# Altium schematic sheet 15. SOC EMIF3 & LPDDR4.SchDoc: LPDDR4 INTERFACE - 4
size 513 x 386 mm; Project: PROC154E2(001)_SK_AM69; Issue: 1.0; RevCode: E3; Page Create Date: March  8, 1995; Variant Name: Core Design; Schematic Page Number: 15; Page Number: 15; Page Size: C; Comment: MISTRAL_TITLEBLK_CSIZE_1; Page Count: 62; Schematic Page Count: 62; Name: PROC154E2 001 SK AM69; DsnPath: C:\Users\danie\Downloads\sprr466c\PROC154E3_RP\PROC154E3_SCH.DSN; SchematicName: SCHEMATIC1; PageName: 15. SOC EMIF3 & LPDDR4; PageSize: C; TopSchematic: True
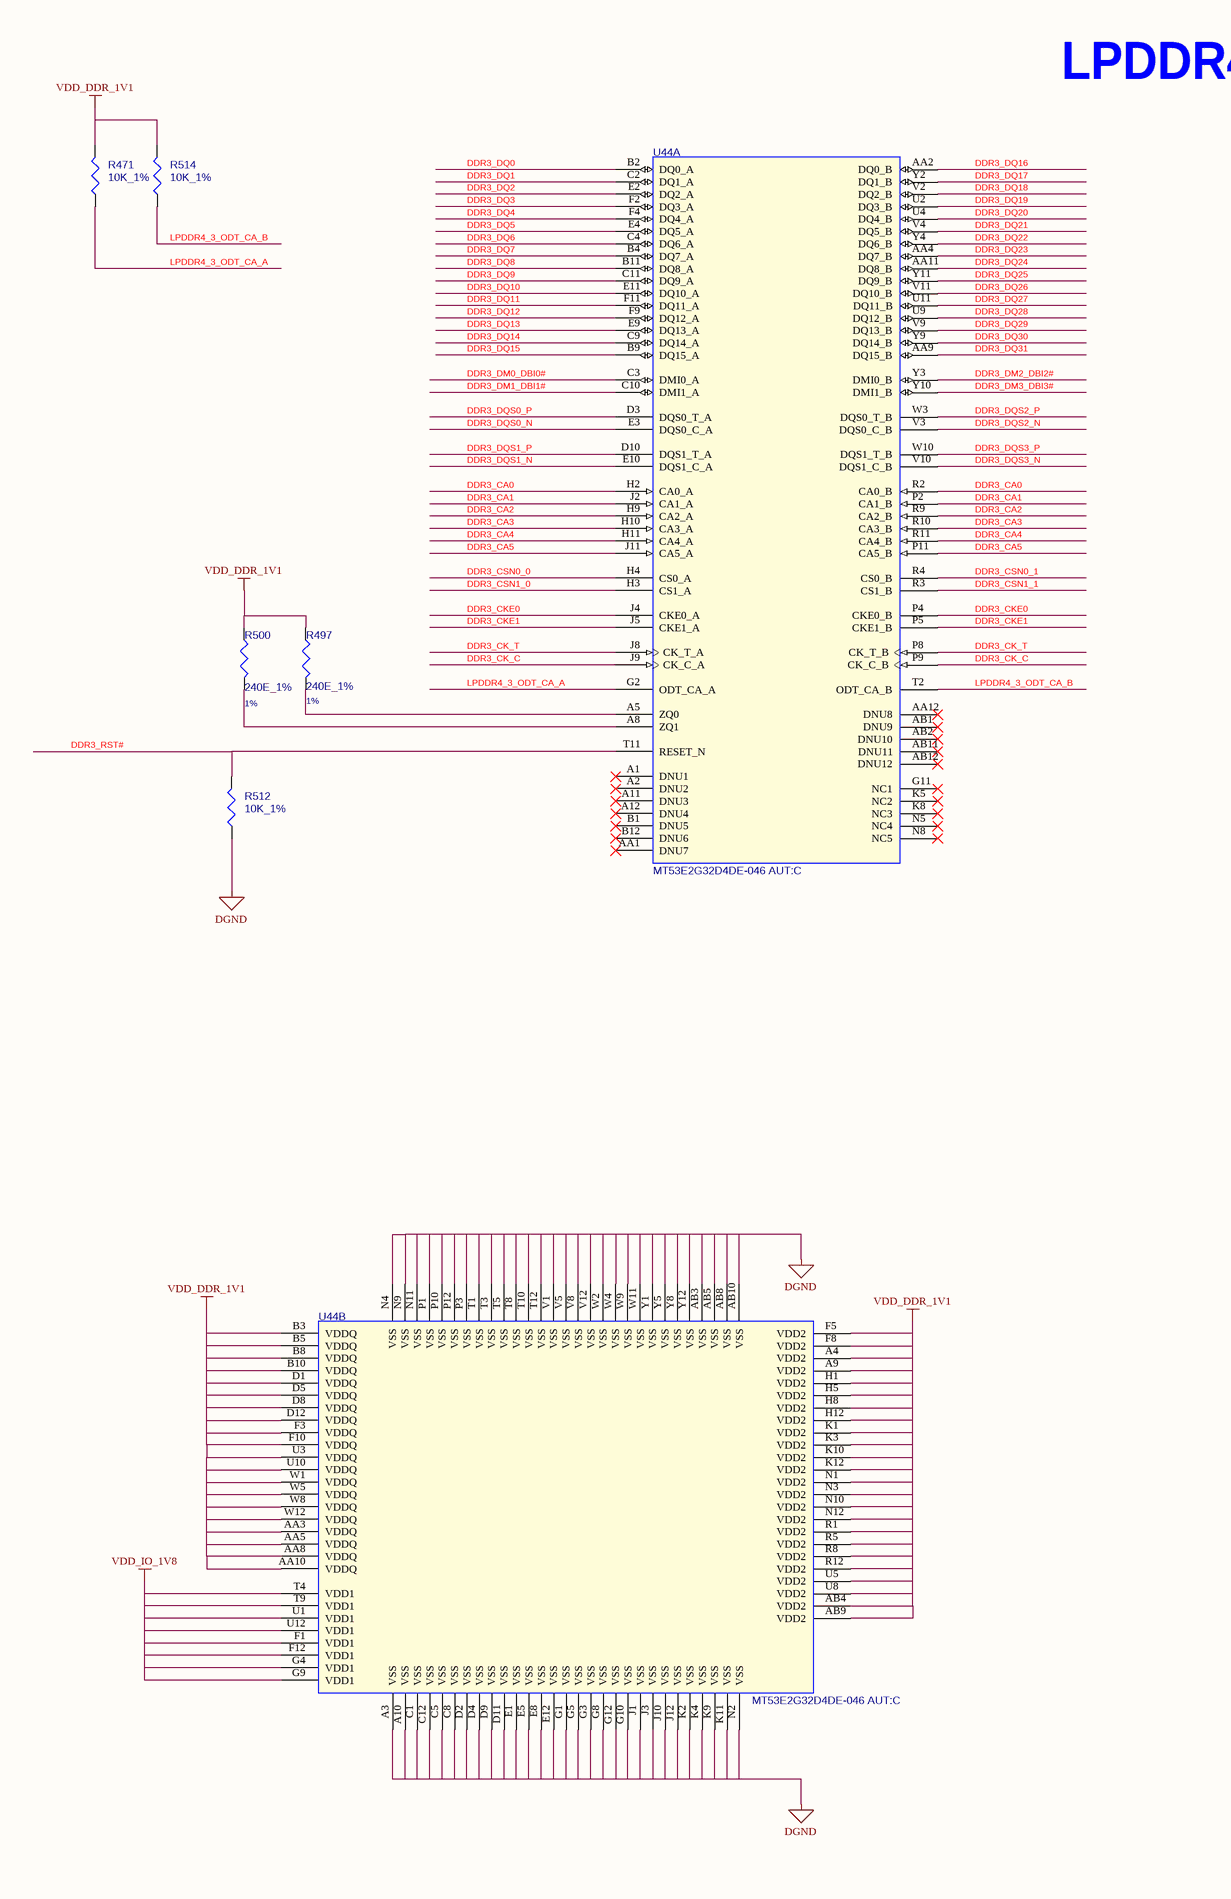
[diagram p0: 15. SOC EMIF3 & LPDDR4.SchDoc, left]
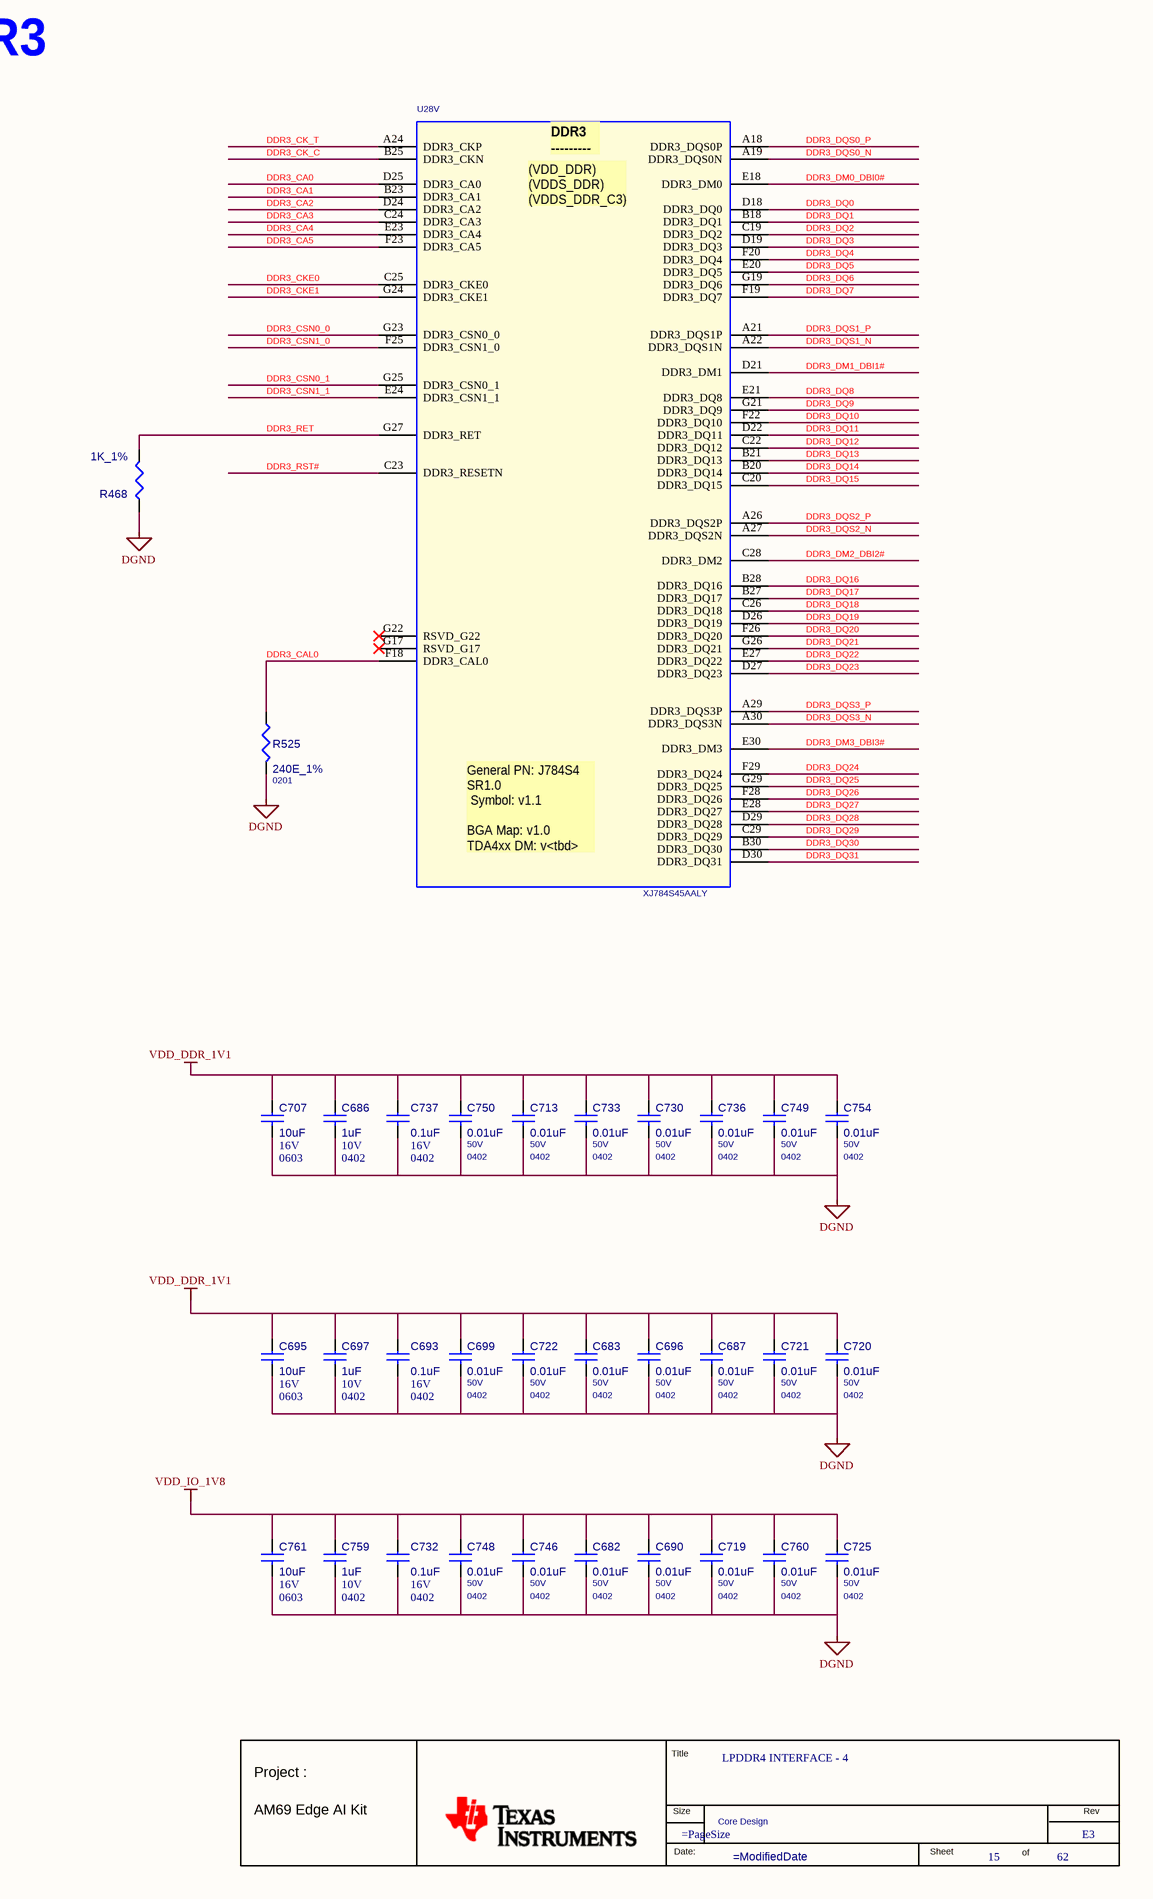
[diagram p1: 15. SOC EMIF3 & LPDDR4.SchDoc, right]

## Parts
*  RevCode: E3  Title: LPDDR4 INTERFACE - 4  Page Number: 15  Page Count: 62  Variant Name: Core Design  (hidden comment: MISTRAL_TITLEBLK_CSIZE_1)  (graphical)
C682  0.01uF  Voltage: 50V  Package: 0402  [CAP0402_0-75]
C683  0.01uF  Voltage: 50V  Package: 0402  [CAP0402_0-75]
C686  1uF  Voltage: 10V  Package: 0402  [CAP0402_0-75]
C687  0.01uF  Voltage: 50V  Package: 0402  [CAP0402_0-75]
C690  0.01uF  Voltage: 50V  Package: 0402  [CAP0402_0-75]
C693  0.1uF  Package: 0402  Voltage: 16V  [CAP0402_0-75]
C695  10uF  Package: 0603  Voltage: 16V  [CAP0603_1]
C696  0.01uF  Voltage: 50V  Package: 0402  [CAP0402_0-75]
C697  1uF  Package: 0402  Voltage: 10V  [CAP0402_0-75]
C699  0.01uF  Voltage: 50V  Package: 0402  [CAP0402_0-75]
C707  10uF  Voltage: 16V  Package: 0603  [CAP0603_1]
C713  0.01uF  Package: 0402  Voltage: 50V  [CAP0402_0-75]
C719  0.01uF  Voltage: 50V  Package: 0402  [CAP0402_0-75]
C720  0.01uF  Voltage: 50V  Package: 0402  [CAP0402_0-75]
C721  0.01uF  Voltage: 50V  Package: 0402  [CAP0402_0-75]
C722  0.01uF  Voltage: 50V  Package: 0402  [CAP0402_0-75]
C725  0.01uF  Voltage: 50V  Package: 0402  [CAP0402_0-75]
C730  0.01uF  Package: 0402  Voltage: 50V  [CAP0402_0-75]
C732  0.1uF  Package: 0402  Voltage: 16V  [CAP0402_0-75]
C733  0.01uF  Package: 0402  Voltage: 50V  [CAP0402_0-75]
C736  0.01uF  Package: 0402  Voltage: 50V  [CAP0402_0-75]
C737  0.1uF  Voltage: 16V  Package: 0402  [CAP0402_0-75]
C746  0.01uF  Voltage: 50V  Package: 0402  [CAP0402_0-75]
C748  0.01uF  Voltage: 50V  Package: 0402  [CAP0402_0-75]
C749  0.01uF  Package: 0402  Voltage: 50V  [CAP0402_0-75]
C750  0.01uF  Package: 0402  Voltage: 50V  [CAP0402_0-75]
C754  0.01uF  Package: 0402  Voltage: 50V  [CAP0402_0-75]
C759  1uF  Package: 0402  Voltage: 10V  [CAP0402_0-75]
C760  0.01uF  Voltage: 50V  Package: 0402  [CAP0402_0-75]
C761  10uF  Package: 0603  Voltage: 16V  [CAP0603_1]
R468  1K_1%  [RES0402_0-5]
R471  10K_1%  [RES0402_0-5]
R497  240E_1%  Tolerance: 1%  [RES0201_0-5]
R500  240E_1%  Tolerance: 1%  [RES0201_0-5]
R512  10K_1%  [RES0402_0-5]
R514  10K_1%  [RES0402_0-5]
R525  240E_1%  Package: 0201  [RES0201_0-5]
U28  XJ784S45AALY  [BGA1414_31-49_1230X1230_2-7]  (part V of 26)
U44  MT53E2G32D4DE-046 AUT:C  [WFBGA200_MT53DDS_400X570_1-2]  (parts A,B of 2)

## Nets
DGND: C682.2 C683.2 C686.2 C687.2 C690.2 C693.2 C695.2 C696.2 C697.2 C699.2 C707.2 C713.2 C719.2 C720.2 C721.2 C722.2 C725.2 C730.2 C732.2 C733.2 C736.2 C737.2 C746.2 C748.2 C749.2 C750.2 C754.2 C759.2 C760.2 C761.2 R468.2 R512.1 R525.2 U44.A3(VSS) U44.A10(VSS) U44.AB3(VSS) U44.AB5(VSS) U44.AB8(VSS) U44.AB10(VSS) U44.C1(VSS) U44.C5(VSS) U44.C8(VSS) U44.C12(VSS) U44.D2(VSS) U44.D4(VSS) U44.D9(VSS) U44.D11(VSS) U44.E1(VSS) U44.E5(VSS) U44.E8(VSS) U44.E12(VSS) U44.G1(VSS) U44.G3(VSS) U44.G5(VSS) U44.G8(VSS) U44.G10(VSS) U44.G12(VSS) U44.J1(VSS) U44.J3(VSS) U44.J10(VSS) U44.J12(VSS) U44.K2(VSS) U44.K4(VSS) U44.K9(VSS) U44.K11(VSS) U44.N2(VSS) U44.N4(VSS) U44.N9(VSS) U44.N11(VSS) U44.P1(VSS) U44.P3(VSS) U44.P10(VSS) U44.P12(VSS) U44.T1(VSS) U44.T3(VSS) U44.T5(VSS) U44.T8(VSS) U44.T10(VSS) U44.T12(VSS) U44.V1(VSS) U44.V5(VSS) U44.V8(VSS) U44.V12(VSS) U44.W2(VSS) U44.W4(VSS) U44.W9(VSS) U44.W11(VSS) U44.Y1(VSS) U44.Y5(VSS) U44.Y8(VSS) U44.Y12(VSS)
VDD_DDR_1V1: C683.1 C686.1 C687.1 C693.1 C695.1 C696.1 C697.1 C699.1 C707.1 C713.1 C720.1 C721.1 C722.1 C730.1 C733.1 C736.1 C737.1 C749.1 C750.1 C754.1 R471.2 R497.1 R500.1 R514.2 U44.A4(VDD2) U44.A9(VDD2) U44.AA3(VDDQ) U44.AA5(VDDQ) U44.AA8(VDDQ) U44.AA10(VDDQ) U44.AB4(VDD2) U44.AB9(VDD2) U44.B3(VDDQ) U44.B5(VDDQ) U44.B8(VDDQ) U44.B10(VDDQ) U44.D1(VDDQ) U44.D5(VDDQ) U44.D8(VDDQ) U44.D12(VDDQ) U44.F3(VDDQ) U44.F5(VDD2) U44.F8(VDD2) U44.F10(VDDQ) U44.H1(VDD2) U44.H5(VDD2) U44.H8(VDD2) U44.H12(VDD2) U44.K1(VDD2) U44.K3(VDD2) U44.K10(VDD2) U44.K12(VDD2) U44.N1(VDD2) U44.N3(VDD2) U44.N10(VDD2) U44.N12(VDD2) U44.R1(VDD2) U44.R5(VDD2) U44.R8(VDD2) U44.R12(VDD2) U44.U3(VDDQ) U44.U5(VDD2) U44.U8(VDD2) U44.U10(VDDQ) U44.W1(VDDQ) U44.W5(VDDQ) U44.W8(VDDQ) U44.W12(VDDQ)
VDD_IO_1V8: C682.1 C690.1 C719.1 C725.1 C732.1 C746.1 C748.1 C759.1 C760.1 C761.1 U44.F1(VDD1) U44.F12(VDD1) U44.G4(VDD1) U44.G9(VDD1) U44.T4(VDD1) U44.T9(VDD1) U44.U1(VDD1) U44.U12(VDD1)
DDR3_CA0: U28.D25(DDR3_CA0) U44.H2(CA0_A) U44.R2(CA0_B)
DDR3_CA1: U28.B23(DDR3_CA1) U44.J2(CA1_A) U44.P2(CA1_B)
DDR3_CA2: U28.D24(DDR3_CA2) U44.H9(CA2_A) U44.R9(CA2_B)
DDR3_CA3: U28.C24(DDR3_CA3) U44.H10(CA3_A) U44.R10(CA3_B)
DDR3_CA4: U28.E23(DDR3_CA4) U44.H11(CA4_A) U44.R11(CA4_B)
DDR3_CA5: U28.F23(DDR3_CA5) U44.J11(CA5_A) U44.P11(CA5_B)
DDR3_CAL0: R525.1 U28.F18(DDR3_CAL0)
DDR3_CK_C: U28.B25(DDR3_CKN) U44.J9(CK_C_A) U44.P9(CK_C_B)
DDR3_CK_T: U28.A24(DDR3_CKP) U44.J8(CK_T_A) U44.P8(CK_T_B)
DDR3_CKE0: U28.C25(DDR3_CKE0) U44.J4(CKE0_A) U44.P4(CKE0_B)
DDR3_CKE1: U28.G24(DDR3_CKE1) U44.J5(CKE1_A) U44.P5(CKE1_B)
DDR3_CSN0_0: U28.G23(DDR3_CSN0_0) U44.H4(CS0_A)
DDR3_CSN0_1: U28.G25(DDR3_CSN0_1) U44.R4(CS0_B)
DDR3_CSN1_0: U28.F25(DDR3_CSN1_0) U44.H3(CS1_A)
DDR3_CSN1_1: U28.E24(DDR3_CSN1_1) U44.R3(CS1_B)
DDR3_DM0_DBI0#: U28.E18(DDR3_DM0) U44.C3(DMI0_A)
DDR3_DM1_DBI1#: U28.D21(DDR3_DM1) U44.C10(DMI1_A)
DDR3_DM2_DBI2#: U28.C28(DDR3_DM2) U44.Y3(DMI0_B)
DDR3_DM3_DBI3#: U28.E30(DDR3_DM3) U44.Y10(DMI1_B)
DDR3_DQ0: U28.D18(DDR3_DQ0) U44.B2(DQ0_A)
DDR3_DQ1: U28.B18(DDR3_DQ1) U44.C2(DQ1_A)
DDR3_DQ2: U28.C19(DDR3_DQ2) U44.E2(DQ2_A)
DDR3_DQ3: U28.D19(DDR3_DQ3) U44.F2(DQ3_A)
DDR3_DQ4: U28.F20(DDR3_DQ4) U44.F4(DQ4_A)
DDR3_DQ5: U28.E20(DDR3_DQ5) U44.E4(DQ5_A)
DDR3_DQ6: U28.G19(DDR3_DQ6) U44.C4(DQ6_A)
DDR3_DQ7: U28.F19(DDR3_DQ7) U44.B4(DQ7_A)
DDR3_DQ8: U28.E21(DDR3_DQ8) U44.B11(DQ8_A)
DDR3_DQ9: U28.G21(DDR3_DQ9) U44.C11(DQ9_A)
DDR3_DQ10: U28.F22(DDR3_DQ10) U44.E11(DQ10_A)
DDR3_DQ11: U28.D22(DDR3_DQ11) U44.F11(DQ11_A)
DDR3_DQ12: U28.C22(DDR3_DQ12) U44.F9(DQ12_A)
DDR3_DQ13: U28.B21(DDR3_DQ13) U44.E9(DQ13_A)
DDR3_DQ14: U28.B20(DDR3_DQ14) U44.C9(DQ14_A)
DDR3_DQ15: U28.C20(DDR3_DQ15) U44.B9(DQ15_A)
DDR3_DQ16: U28.B28(DDR3_DQ16) U44.AA2(DQ0_B)
DDR3_DQ17: U28.B27(DDR3_DQ17) U44.Y2(DQ1_B)
DDR3_DQ18: U28.C26(DDR3_DQ18) U44.V2(DQ2_B)
DDR3_DQ19: U28.D26(DDR3_DQ19) U44.U2(DQ3_B)
DDR3_DQ20: U28.F26(DDR3_DQ20) U44.U4(DQ4_B)
DDR3_DQ21: U28.G26(DDR3_DQ21) U44.V4(DQ5_B)
DDR3_DQ22: U28.E27(DDR3_DQ22) U44.Y4(DQ6_B)
DDR3_DQ23: U28.D27(DDR3_DQ23) U44.AA4(DQ7_B)
DDR3_DQ24: U28.F29(DDR3_DQ24) U44.AA11(DQ8_B)
DDR3_DQ25: U28.G29(DDR3_DQ25) U44.Y11(DQ9_B)
DDR3_DQ26: U28.F28(DDR3_DQ26) U44.V11(DQ10_B)
DDR3_DQ27: U28.E28(DDR3_DQ27) U44.U11(DQ11_B)
DDR3_DQ28: U28.D29(DDR3_DQ28) U44.U9(DQ12_B)
DDR3_DQ29: U28.C29(DDR3_DQ29) U44.V9(DQ13_B)
DDR3_DQ30: U28.B30(DDR3_DQ30) U44.Y9(DQ14_B)
DDR3_DQ31: U28.D30(DDR3_DQ31) U44.AA9(DQ15_B)
DDR3_DQS0_N: U28.A19(DDR3_DQS0N) U44.E3(DQS0_C_A)
DDR3_DQS0_P: U28.A18(DDR3_DQS0P) U44.D3(DQS0_T_A)
DDR3_DQS1_N: U28.A22(DDR3_DQS1N) U44.E10(DQS1_C_A)
DDR3_DQS1_P: U28.A21(DDR3_DQS1P) U44.D10(DQS1_T_A)
DDR3_DQS2_N: U28.A27(DDR3_DQS2N) U44.V3(DQS0_C_B)
DDR3_DQS2_P: U28.A26(DDR3_DQS2P) U44.W3(DQS0_T_B)
DDR3_DQS3_N: U28.A30(DDR3_DQS3N) U44.V10(DQS1_C_B)
DDR3_DQS3_P: U28.A29(DDR3_DQS3P) U44.W10(DQS1_T_B)
DDR3_RET: R468.1 U28.G27(DDR3_RET)
DDR3_RST#: R512.2 U28.C23(DDR3_RESETN) U44.T11(RESET_N)
LPDDR4_3_ODT_CA_A: R471.1 U44.G2(ODT_CA_A)
LPDDR4_3_ODT_CA_B: R514.1 U44.T2(ODT_CA_B)
NetR497_2: R497.2 U44.A5(ZQ0)
NetR500_2: R500.2 U44.A8(ZQ1)

Not connected (* = marked no-connect by the designer): U28 G17(RSVD_G17)* G22(RSVD_G22)*; U44 A1(DNU1)* A2(DNU2)* A11(DNU3)* A12(DNU4)* AA1(DNU7)* AA12(DNU8)* AB1(DNU9)* AB2(DNU10)* AB11(DNU11)* AB12(DNU12)* B1(DNU5)* B12(DNU6)* G11(NC1)* K5(NC2)* K8(NC3)* N5(NC4)* N8(NC5)*

## Notes on the sheet
- LPDDR4 - DDR3
- (in symbol J7AHPSoC-EVM_BGA1414, part V) DDR3 / ---------; (VDD_DDR) / (VDDS_DDR) / (VDDS_DDR_C3); General PN: J784S4 / SR1.0 / Symbol: v1.1 / BGA Map: v1.0 / TDA4xx DM: v<tbd>
- (in symbol MISTRAL_TITLEBLK_CSIZE_1) Title; Project :; Size; Rev; AM69 Edge AI Kit; Date:; Sheet; of

## Library data of the parts
* = MISTRAL_TITLEBLK_CSIZE_1: Issue: 1.0; Project: PROC154E2(001)_SK_AM69; Name: PROC154E2 001 SK AM69; Page Create Date: March  8, 1995; Page Size: =PageSize; Page Modify Date: =ModifiedDate; Schematic Page Count: 62; Schematic Page Number: 15
C682 = CAP_Dup1: CAP CERAMIC 0.01uF 50V 10% X7R 0402; Part Reference: C682; Mistral Part No: 120009030025-R; Mfr_name: KEMET; Mfr_part_number: C0402C103K5RACTU; Part_type: CAPACITORS\CERAMIC; Direct Alternate_mfr_name: TDK; Direct Alternate_mfr_part_number: C1005X7R1H103K050BE; Automotive Alternate_mfr_part_number: CGA2B3X7R1H103K050BB; Project: G4_SVGA; Customs_HS_Code: 85322990; Custom_Duty: 15%; Wattage: NA; Value: 0.01uF; Tolerance: 10%; Distributor_name: DIGIKEY; Distributor_part_number: 399-3066-1-ND; Library Ref: CAP; Height: 0.55MM; Datasheet: Y:\MIS_DATABASE\DATASHEETS\CAPACITORS\KEMET-C-X7R.PDF; Crtd /date: MAZHAR/040505; Chkd/date: SHREESHAIL/301105; Footprint Ref: CAP0402_0-75; Weight: 0.65mg; Temperature: -55°C+125°C; MECHANICAL 3D STEP FILE: CAP0402_0-75; Library Path: Y:\MIS_DATABASE\Library\ALTIUM_TOOL\SCHEMATICS_PARTS\MS_DISCRETE_Library.schlib; Footprint Path: Y:\MIS_DATABASE\Library\ALTIUM_TOOL\PCB_FOOTPRINTS\Altium_Footprint_Lib.PcbLib; Automotive Alternate_mfr_name: TDK; PCB Footprint: CAP0402_0-75
C683 = CAP_Dup1: CAP CERAMIC 0.01uF 50V 10% X7R 0402; Part Reference: C683; Mistral Part No: 120009030025-R; Mfr_name: KEMET; Mfr_part_number: C0402C103K5RACTU; Part_type: CAPACITORS\CERAMIC; Direct Alternate_mfr_name: TDK; Direct Alternate_mfr_part_number: C1005X7R1H103K050BE; Automotive Alternate_mfr_part_number: CGA2B3X7R1H103K050BB; Project: G4_SVGA; Customs_HS_Code: 85322990; Custom_Duty: 15%; Wattage: NA; Value: 0.01uF; Tolerance: 10%; Distributor_name: DIGIKEY; Distributor_part_number: 399-3066-1-ND; Library Ref: CAP; Height: 0.55MM; Datasheet: Y:\MIS_DATABASE\DATASHEETS\CAPACITORS\KEMET-C-X7R.PDF; Crtd /date: MAZHAR/040505; Chkd/date: SHREESHAIL/301105; Footprint Ref: CAP0402_0-75; Weight: 0.65mg; Temperature: -55°C+125°C; MECHANICAL 3D STEP FILE: CAP0402_0-75; Library Path: Y:\MIS_DATABASE\Library\ALTIUM_TOOL\SCHEMATICS_PARTS\MS_DISCRETE_Library.schlib; Footprint Path: Y:\MIS_DATABASE\Library\ALTIUM_TOOL\PCB_FOOTPRINTS\Altium_Footprint_Lib.PcbLib; Automotive Alternate_mfr_name: TDK; PCB Footprint: CAP0402_0-75
C686 = CAP_Dup1: CAP CERAMIC 1uF 10V 10% X7S AUTO 0402; Part Reference: C686; Mistral Part No: 120018090021-R; Mfr_name: MURATA; Mfr_part_number: GCM155C71A105KE38D; Part_type: CAPACITORS\CERAMIC; Project: SMART-M_SCRIPTALK_PB; Wattage: NA; Customs_HS_Code: 85322990; Custom_Duty: 15%; Value: 1uF; Footprint Ref: CAP0402_0-75; Library Ref: CAP; Tolerance: 10%; Distributor_name: DIGIKEY; Distributor_part_number: 490-13409-1-ND; Height: 0.70MM; Weight: 6mg; Temperature: -55°C+125°C; Datasheet: Y:\MIS_DATABASE\DATASHEETS\CAPACITORS\MURATA-GCM-SER.PDF; Crtd /date: ALVY/100918; Chkd/date: MANIRAJA/100918; MECHANICAL 3D STEP FILE: CAP0402_0-75; Library Path: Y:\MIS_DATABASE\Library\ALTIUM_TOOL\SCHEMATICS_PARTS\MS_DISCRETE_Library.schlib; Footprint Path: Y:\MIS_DATABASE\Library\ALTIUM_TOOL\PCB_FOOTPRINTS\Altium_Footprint_Lib.PcbLib; PCB Footprint: CAP0402_0-75
C687 = CAP_Dup1: CAP CERAMIC 0.01uF 50V 10% X7R 0402; Part Reference: C687; Mistral Part No: 120009030025-R; Mfr_name: KEMET; Mfr_part_number: C0402C103K5RACTU; Part_type: CAPACITORS\CERAMIC; Direct Alternate_mfr_name: TDK; Direct Alternate_mfr_part_number: C1005X7R1H103K050BE; Automotive Alternate_mfr_part_number: CGA2B3X7R1H103K050BB; Project: G4_SVGA; Customs_HS_Code: 85322990; Custom_Duty: 15%; Wattage: NA; Value: 0.01uF; Tolerance: 10%; Distributor_name: DIGIKEY; Distributor_part_number: 399-3066-1-ND; Library Ref: CAP; Height: 0.55MM; Datasheet: Y:\MIS_DATABASE\DATASHEETS\CAPACITORS\KEMET-C-X7R.PDF; Crtd /date: MAZHAR/040505; Chkd/date: SHREESHAIL/301105; Footprint Ref: CAP0402_0-75; Weight: 0.65mg; Temperature: -55°C+125°C; MECHANICAL 3D STEP FILE: CAP0402_0-75; Library Path: Y:\MIS_DATABASE\Library\ALTIUM_TOOL\SCHEMATICS_PARTS\MS_DISCRETE_Library.schlib; Footprint Path: Y:\MIS_DATABASE\Library\ALTIUM_TOOL\PCB_FOOTPRINTS\Altium_Footprint_Lib.PcbLib; Automotive Alternate_mfr_name: TDK; PCB Footprint: CAP0402_0-75
C690 = CAP_Dup1: CAP CERAMIC 0.01uF 50V 10% X7R 0402; Part Reference: C690; Mistral Part No: 120009030025-R; Mfr_name: KEMET; Mfr_part_number: C0402C103K5RACTU; Part_type: CAPACITORS\CERAMIC; Direct Alternate_mfr_name: TDK; Direct Alternate_mfr_part_number: C1005X7R1H103K050BE; Automotive Alternate_mfr_part_number: CGA2B3X7R1H103K050BB; Project: G4_SVGA; Customs_HS_Code: 85322990; Custom_Duty: 15%; Wattage: NA; Value: 0.01uF; Tolerance: 10%; Distributor_name: DIGIKEY; Distributor_part_number: 399-3066-1-ND; Library Ref: CAP; Height: 0.55MM; Datasheet: Y:\MIS_DATABASE\DATASHEETS\CAPACITORS\KEMET-C-X7R.PDF; Crtd /date: MAZHAR/040505; Chkd/date: SHREESHAIL/301105; Footprint Ref: CAP0402_0-75; Weight: 0.65mg; Temperature: -55°C+125°C; MECHANICAL 3D STEP FILE: CAP0402_0-75; Library Path: Y:\MIS_DATABASE\Library\ALTIUM_TOOL\SCHEMATICS_PARTS\MS_DISCRETE_Library.schlib; Footprint Path: Y:\MIS_DATABASE\Library\ALTIUM_TOOL\PCB_FOOTPRINTS\Altium_Footprint_Lib.PcbLib; Automotive Alternate_mfr_name: TDK; PCB Footprint: CAP0402_0-75
C693 = CAP_Dup1: CAP CERAMIC 0.1uF 16V 5% X7R AUTO 0402; Part Reference: C693; Part_type: CAPACITORS\CERAMIC; Mfr_part_number: GCM155R71C104JA55D; Mfr_name: MURATA; Mistral Part No: 120018100055-R; Direct Alternate_mfr_name: TDK; Direct Alternate_mfr_part_number: CGA2B1X7R1C104K050BC; Custom_Duty: 15%; Customs_HS_Code: 85322990; Wattage: NA; Project: TI_J7ES_EVM_CP; Value: 0.1uF; MECHANICAL 3D STEP FILE: CAP0402_0-75; Footprint Path: Y:\MIS_DATABASE\Library\ALTIUM_TOOL\PCB_FOOTPRINTS\Altium_Footprint_Lib.PcbLib; Library Path: Y:\MIS_DATABASE\Library\ALTIUM_TOOL\SCHEMATICS_PARTS\MS_DISCRETE_Library.schlib; Footprint Ref: CAP0402_0-75; Library Ref: CAP; Chkd/date: MANIRAJA/241018; Crtd /date: ALVY/241018; Datasheet: Y:\MIS_DATABASE\DATASHEETS\CAPACITORS\GCM155R71C104JA55D.PDF; Temperature: -55°C+125°C; Weight: 6mg; Height: 0.55MM; Distributor_part_number: 490-16433-1-ND; Distributor_name: DIGIKEY; Tolerance: 5%; Automotive Alternate_mfr_name: TDK; Automotive Alternate_mfr_part_number: CGA2B1X7R1C104K050BC; PCB Footprint: CAP0402_0-75
C695 = CAP_Dup1: CAP CERAMIC 10uF 16V 20% X6S 0603; Part Reference: C695; Automotive Alternate_mfr_part_number: GRT188C81C106ME13D; Automotive Alternate_mfr_name: MURATA; Direct Alternate_mfr_part_number: CL10X106MO8NRNC; Direct Alternate_mfr_name: SAMSUNG; Part_type: CAPACITORS\CERAMIC; Mfr_part_number: GRM188C81C106MA73D; Mistral Part No: 120017010004-R; Custom_Duty: 15%; Customs_HS_Code: 85322990; Wattage: NA; Project: TRMM_SMART-M_PS; Value: 10uF; Footprint Path: Y:\MIS_DATABASE\Library\ALTIUM_TOOL\PCB_FOOTPRINTS\Altium_Footprint_Lib.PcbLib; Library Path: Y:\MIS_DATABASE\Library\ALTIUM_TOOL\SCHEMATICS_PARTS\MS_DISCRETE_Library.schlib; Footprint Ref: CAP0603_1; MECHANICAL 3D STEP FILE: CAP0603_1; Chkd/date: VASANTHA/170117; Crtd /date: VASANTHA/170117; Datasheet: Y:\MIS_DATABASE\DATASHEETS\CAPACITORS\MURATA-GXX-SER_NOV17.PDF; Temperature: -55°C+105°C; Weight: 6.3mg; Height: 0.90MM; Library Ref: CAP; Distributor_part_number: 490-7198-1-ND; Distributor_name: DIGIKEY; Tolerance: 20%; Mfr_name: MURATA; PCB Footprint: CAP0603_1
C696 = CAP_Dup1: CAP CERAMIC 0.01uF 50V 10% X7R 0402; Part Reference: C696; Mistral Part No: 120009030025-R; Mfr_name: KEMET; Mfr_part_number: C0402C103K5RACTU; Part_type: CAPACITORS\CERAMIC; Direct Alternate_mfr_name: TDK; Direct Alternate_mfr_part_number: C1005X7R1H103K050BE; Automotive Alternate_mfr_part_number: CGA2B3X7R1H103K050BB; Project: G4_SVGA; Customs_HS_Code: 85322990; Custom_Duty: 15%; Wattage: NA; Value: 0.01uF; Tolerance: 10%; Distributor_name: DIGIKEY; Distributor_part_number: 399-3066-1-ND; Library Ref: CAP; Height: 0.55MM; Datasheet: Y:\MIS_DATABASE\DATASHEETS\CAPACITORS\KEMET-C-X7R.PDF; Crtd /date: MAZHAR/040505; Chkd/date: SHREESHAIL/301105; Footprint Ref: CAP0402_0-75; Weight: 0.65mg; Temperature: -55°C+125°C; MECHANICAL 3D STEP FILE: CAP0402_0-75; Library Path: Y:\MIS_DATABASE\Library\ALTIUM_TOOL\SCHEMATICS_PARTS\MS_DISCRETE_Library.schlib; Footprint Path: Y:\MIS_DATABASE\Library\ALTIUM_TOOL\PCB_FOOTPRINTS\Altium_Footprint_Lib.PcbLib; Automotive Alternate_mfr_name: TDK; PCB Footprint: CAP0402_0-75
C697 = CAP_Dup1: CAP CERAMIC 1uF 10V 10% X7S AUTO 0402; Part Reference: C697; Part_type: CAPACITORS\CERAMIC; Mfr_part_number: GCM155C71A105KE38D; Mfr_name: MURATA; Mistral Part No: 120018090021-R; Custom_Duty: 15%; Customs_HS_Code: 85322990; Wattage: NA; Project: SMART-M_SCRIPTALK_PB; Value: 1uF; Footprint Path: Y:\MIS_DATABASE\Library\ALTIUM_TOOL\PCB_FOOTPRINTS\Altium_Footprint_Lib.PcbLib; Library Path: Y:\MIS_DATABASE\Library\ALTIUM_TOOL\SCHEMATICS_PARTS\MS_DISCRETE_Library.schlib; MECHANICAL 3D STEP FILE: CAP0402_0-75; Chkd/date: MANIRAJA/100918; Crtd /date: ALVY/100918; Datasheet: Y:\MIS_DATABASE\DATASHEETS\CAPACITORS\MURATA-GCM-SER.PDF; Temperature: -55°C+125°C; Weight: 6mg; Height: 0.70MM; Distributor_part_number: 490-13409-1-ND; Distributor_name: DIGIKEY; Tolerance: 10%; Library Ref: CAP; Footprint Ref: CAP0402_0-75; PCB Footprint: CAP0402_0-75
C699 = CAP_Dup1: CAP CERAMIC 0.01uF 50V 10% X7R 0402; Part Reference: C699; Mistral Part No: 120009030025-R; Mfr_name: KEMET; Mfr_part_number: C0402C103K5RACTU; Part_type: CAPACITORS\CERAMIC; Direct Alternate_mfr_name: TDK; Direct Alternate_mfr_part_number: C1005X7R1H103K050BE; Automotive Alternate_mfr_part_number: CGA2B3X7R1H103K050BB; Project: G4_SVGA; Customs_HS_Code: 85322990; Custom_Duty: 15%; Wattage: NA; Value: 0.01uF; Tolerance: 10%; Distributor_name: DIGIKEY; Distributor_part_number: 399-3066-1-ND; Library Ref: CAP; Height: 0.55MM; Datasheet: Y:\MIS_DATABASE\DATASHEETS\CAPACITORS\KEMET-C-X7R.PDF; Crtd /date: MAZHAR/040505; Chkd/date: SHREESHAIL/301105; Footprint Ref: CAP0402_0-75; Weight: 0.65mg; Temperature: -55°C+125°C; MECHANICAL 3D STEP FILE: CAP0402_0-75; Library Path: Y:\MIS_DATABASE\Library\ALTIUM_TOOL\SCHEMATICS_PARTS\MS_DISCRETE_Library.schlib; Footprint Path: Y:\MIS_DATABASE\Library\ALTIUM_TOOL\PCB_FOOTPRINTS\Altium_Footprint_Lib.PcbLib; Automotive Alternate_mfr_name: TDK; PCB Footprint: CAP0402_0-75
C707 = CAP_Dup1: CAP CERAMIC 10uF 16V 20% X6S 0603; Part Reference: C707; Mistral Part No: 120017010004-R; Mfr_name: MURATA; Mfr_part_number: GRM188C81C106MA73D; Part_type: CAPACITORS\CERAMIC; Direct Alternate_mfr_name: SAMSUNG; Direct Alternate_mfr_part_number: CL10X106MO8NRNC; Automotive Alternate_mfr_part_number: GRT188C81C106ME13D; Project: TRMM_SMART-M_PS; Wattage: NA; Customs_HS_Code: 85322990; Custom_Duty: 15%; Value: 10uF; Tolerance: 20%; Distributor_name: DIGIKEY; Distributor_part_number: 490-7198-1-ND; Library Ref: CAP; Height: 0.90MM; Weight: 6.3mg; Temperature: -55°C+105°C; Datasheet: Y:\MIS_DATABASE\DATASHEETS\CAPACITORS\MURATA-GXX-SER_NOV17.PDF; Crtd /date: VASANTHA/170117; Chkd/date: VASANTHA/170117; MECHANICAL 3D STEP FILE: CAP0603_1; Footprint Ref: CAP0603_1; Library Path: Y:\MIS_DATABASE\Library\ALTIUM_TOOL\SCHEMATICS_PARTS\MS_DISCRETE_Library.schlib; Footprint Path: Y:\MIS_DATABASE\Library\ALTIUM_TOOL\PCB_FOOTPRINTS\Altium_Footprint_Lib.PcbLib; Automotive Alternate_mfr_name: MURATA; PCB Footprint: CAP0603_1
C713 = CAP_Dup1: CAP CERAMIC 0.01uF 50V 10% X7R 0402; Part Reference: C713; Automotive Alternate_mfr_part_number: CGA2B3X7R1H103K050BB; Automotive Alternate_mfr_name: TDK; Direct Alternate_mfr_part_number: C1005X7R1H103K050BE; Part_type: CAPACITORS\CERAMIC; Mfr_part_number: C0402C103K5RACTU; Mfr_name: KEMET; Mistral Part No: 120009030025-R; Wattage: NA; Custom_Duty: 15%; Customs_HS_Code: 85322990; Project: G4_SVGA; Value: 0.01uF; Direct Alternate_mfr_name: TDK; Footprint Path: Y:\MIS_DATABASE\Library\ALTIUM_TOOL\PCB_FOOTPRINTS\Altium_Footprint_Lib.PcbLib; Library Path: Y:\MIS_DATABASE\Library\ALTIUM_TOOL\SCHEMATICS_PARTS\MS_DISCRETE_Library.schlib; MECHANICAL 3D STEP FILE: CAP0402_0-75; Temperature: -55°C+125°C; Weight: 0.65mg; Footprint Ref: CAP0402_0-75; Chkd/date: SHREESHAIL/301105; Crtd /date: MAZHAR/040505; Datasheet: Y:\MIS_DATABASE\DATASHEETS\CAPACITORS\KEMET-C-X7R.PDF; Height: 0.55MM; Library Ref: CAP; Distributor_part_number: 399-3066-1-ND; Distributor_name: DIGIKEY; Tolerance: 10%; PCB Footprint: CAP0402_0-75
C719 = CAP_Dup1: CAP CERAMIC 0.01uF 50V 10% X7R 0402; Part Reference: C719; Mistral Part No: 120009030025-R; Mfr_name: KEMET; Mfr_part_number: C0402C103K5RACTU; Part_type: CAPACITORS\CERAMIC; Direct Alternate_mfr_name: TDK; Direct Alternate_mfr_part_number: C1005X7R1H103K050BE; Automotive Alternate_mfr_part_number: CGA2B3X7R1H103K050BB; Project: G4_SVGA; Customs_HS_Code: 85322990; Custom_Duty: 15%; Wattage: NA; Value: 0.01uF; Tolerance: 10%; Distributor_name: DIGIKEY; Distributor_part_number: 399-3066-1-ND; Library Ref: CAP; Height: 0.55MM; Datasheet: Y:\MIS_DATABASE\DATASHEETS\CAPACITORS\KEMET-C-X7R.PDF; Crtd /date: MAZHAR/040505; Chkd/date: SHREESHAIL/301105; Footprint Ref: CAP0402_0-75; Weight: 0.65mg; Temperature: -55°C+125°C; MECHANICAL 3D STEP FILE: CAP0402_0-75; Library Path: Y:\MIS_DATABASE\Library\ALTIUM_TOOL\SCHEMATICS_PARTS\MS_DISCRETE_Library.schlib; Footprint Path: Y:\MIS_DATABASE\Library\ALTIUM_TOOL\PCB_FOOTPRINTS\Altium_Footprint_Lib.PcbLib; Automotive Alternate_mfr_name: TDK; PCB Footprint: CAP0402_0-75
C720 = CAP_Dup1: CAP CERAMIC 0.01uF 50V 10% X7R 0402; Part Reference: C720; Mistral Part No: 120009030025-R; Mfr_name: KEMET; Mfr_part_number: C0402C103K5RACTU; Part_type: CAPACITORS\CERAMIC; Direct Alternate_mfr_name: TDK; Direct Alternate_mfr_part_number: C1005X7R1H103K050BE; Automotive Alternate_mfr_part_number: CGA2B3X7R1H103K050BB; Project: G4_SVGA; Customs_HS_Code: 85322990; Custom_Duty: 15%; Wattage: NA; Value: 0.01uF; Tolerance: 10%; Distributor_name: DIGIKEY; Distributor_part_number: 399-3066-1-ND; Library Ref: CAP; Height: 0.55MM; Datasheet: Y:\MIS_DATABASE\DATASHEETS\CAPACITORS\KEMET-C-X7R.PDF; Crtd /date: MAZHAR/040505; Chkd/date: SHREESHAIL/301105; Footprint Ref: CAP0402_0-75; Weight: 0.65mg; Temperature: -55°C+125°C; MECHANICAL 3D STEP FILE: CAP0402_0-75; Library Path: Y:\MIS_DATABASE\Library\ALTIUM_TOOL\SCHEMATICS_PARTS\MS_DISCRETE_Library.schlib; Footprint Path: Y:\MIS_DATABASE\Library\ALTIUM_TOOL\PCB_FOOTPRINTS\Altium_Footprint_Lib.PcbLib; Automotive Alternate_mfr_name: TDK; PCB Footprint: CAP0402_0-75
C721 = CAP_Dup1: CAP CERAMIC 0.01uF 50V 10% X7R 0402; Part Reference: C721; Mistral Part No: 120009030025-R; Mfr_name: KEMET; Mfr_part_number: C0402C103K5RACTU; Part_type: CAPACITORS\CERAMIC; Direct Alternate_mfr_name: TDK; Direct Alternate_mfr_part_number: C1005X7R1H103K050BE; Automotive Alternate_mfr_part_number: CGA2B3X7R1H103K050BB; Project: G4_SVGA; Customs_HS_Code: 85322990; Custom_Duty: 15%; Wattage: NA; Value: 0.01uF; Tolerance: 10%; Distributor_name: DIGIKEY; Distributor_part_number: 399-3066-1-ND; Library Ref: CAP; Height: 0.55MM; Datasheet: Y:\MIS_DATABASE\DATASHEETS\CAPACITORS\KEMET-C-X7R.PDF; Crtd /date: MAZHAR/040505; Chkd/date: SHREESHAIL/301105; Footprint Ref: CAP0402_0-75; Weight: 0.65mg; Temperature: -55°C+125°C; MECHANICAL 3D STEP FILE: CAP0402_0-75; Library Path: Y:\MIS_DATABASE\Library\ALTIUM_TOOL\SCHEMATICS_PARTS\MS_DISCRETE_Library.schlib; Footprint Path: Y:\MIS_DATABASE\Library\ALTIUM_TOOL\PCB_FOOTPRINTS\Altium_Footprint_Lib.PcbLib; Automotive Alternate_mfr_name: TDK; PCB Footprint: CAP0402_0-75
C722 = CAP_Dup1: CAP CERAMIC 0.01uF 50V 10% X7R 0402; Part Reference: C722; Mistral Part No: 120009030025-R; Mfr_name: KEMET; Mfr_part_number: C0402C103K5RACTU; Part_type: CAPACITORS\CERAMIC; Direct Alternate_mfr_name: TDK; Direct Alternate_mfr_part_number: C1005X7R1H103K050BE; Automotive Alternate_mfr_part_number: CGA2B3X7R1H103K050BB; Project: G4_SVGA; Customs_HS_Code: 85322990; Custom_Duty: 15%; Wattage: NA; Value: 0.01uF; Tolerance: 10%; Distributor_name: DIGIKEY; Distributor_part_number: 399-3066-1-ND; Library Ref: CAP; Height: 0.55MM; Datasheet: Y:\MIS_DATABASE\DATASHEETS\CAPACITORS\KEMET-C-X7R.PDF; Crtd /date: MAZHAR/040505; Chkd/date: SHREESHAIL/301105; Footprint Ref: CAP0402_0-75; Weight: 0.65mg; Temperature: -55°C+125°C; MECHANICAL 3D STEP FILE: CAP0402_0-75; Library Path: Y:\MIS_DATABASE\Library\ALTIUM_TOOL\SCHEMATICS_PARTS\MS_DISCRETE_Library.schlib; Footprint Path: Y:\MIS_DATABASE\Library\ALTIUM_TOOL\PCB_FOOTPRINTS\Altium_Footprint_Lib.PcbLib; Automotive Alternate_mfr_name: TDK; PCB Footprint: CAP0402_0-75
C725 = CAP_Dup1: CAP CERAMIC 0.01uF 50V 10% X7R 0402; Part Reference: C725; Mistral Part No: 120009030025-R; Mfr_name: KEMET; Mfr_part_number: C0402C103K5RACTU; Part_type: CAPACITORS\CERAMIC; Direct Alternate_mfr_name: TDK; Direct Alternate_mfr_part_number: C1005X7R1H103K050BE; Automotive Alternate_mfr_part_number: CGA2B3X7R1H103K050BB; Project: G4_SVGA; Customs_HS_Code: 85322990; Custom_Duty: 15%; Wattage: NA; Value: 0.01uF; Tolerance: 10%; Distributor_name: DIGIKEY; Distributor_part_number: 399-3066-1-ND; Library Ref: CAP; Height: 0.55MM; Datasheet: Y:\MIS_DATABASE\DATASHEETS\CAPACITORS\KEMET-C-X7R.PDF; Crtd /date: MAZHAR/040505; Chkd/date: SHREESHAIL/301105; Footprint Ref: CAP0402_0-75; Weight: 0.65mg; Temperature: -55°C+125°C; MECHANICAL 3D STEP FILE: CAP0402_0-75; Library Path: Y:\MIS_DATABASE\Library\ALTIUM_TOOL\SCHEMATICS_PARTS\MS_DISCRETE_Library.schlib; Footprint Path: Y:\MIS_DATABASE\Library\ALTIUM_TOOL\PCB_FOOTPRINTS\Altium_Footprint_Lib.PcbLib; Automotive Alternate_mfr_name: TDK; PCB Footprint: CAP0402_0-75
C730 = CAP_Dup1: CAP CERAMIC 0.01uF 50V 10% X7R 0402; Part Reference: C730; Automotive Alternate_mfr_part_number: CGA2B3X7R1H103K050BB; Automotive Alternate_mfr_name: TDK; Direct Alternate_mfr_part_number: C1005X7R1H103K050BE; Part_type: CAPACITORS\CERAMIC; Mfr_part_number: C0402C103K5RACTU; Mfr_name: KEMET; Mistral Part No: 120009030025-R; Wattage: NA; Custom_Duty: 15%; Customs_HS_Code: 85322990; Project: G4_SVGA; Value: 0.01uF; Direct Alternate_mfr_name: TDK; Footprint Path: Y:\MIS_DATABASE\Library\ALTIUM_TOOL\PCB_FOOTPRINTS\Altium_Footprint_Lib.PcbLib; Library Path: Y:\MIS_DATABASE\Library\ALTIUM_TOOL\SCHEMATICS_PARTS\MS_DISCRETE_Library.schlib; MECHANICAL 3D STEP FILE: CAP0402_0-75; Temperature: -55°C+125°C; Weight: 0.65mg; Footprint Ref: CAP0402_0-75; Chkd/date: SHREESHAIL/301105; Crtd /date: MAZHAR/040505; Datasheet: Y:\MIS_DATABASE\DATASHEETS\CAPACITORS\KEMET-C-X7R.PDF; Height: 0.55MM; Library Ref: CAP; Distributor_part_number: 399-3066-1-ND; Distributor_name: DIGIKEY; Tolerance: 10%; PCB Footprint: CAP0402_0-75
C732 = CAP_Dup1: CAP CERAMIC 0.1uF 16V 5% X7R AUTO 0402; Part Reference: C732; Part_type: CAPACITORS\CERAMIC; Mfr_part_number: GCM155R71C104JA55D; Mfr_name: MURATA; Mistral Part No: 120018100055-R; Direct Alternate_mfr_name: TDK; Direct Alternate_mfr_part_number: CGA2B1X7R1C104K050BC; Custom_Duty: 15%; Customs_HS_Code: 85322990; Wattage: NA; Project: TI_J7ES_EVM_CP; Value: 0.1uF; MECHANICAL 3D STEP FILE: CAP0402_0-75; Footprint Path: Y:\MIS_DATABASE\Library\ALTIUM_TOOL\PCB_FOOTPRINTS\Altium_Footprint_Lib.PcbLib; Library Path: Y:\MIS_DATABASE\Library\ALTIUM_TOOL\SCHEMATICS_PARTS\MS_DISCRETE_Library.schlib; Footprint Ref: CAP0402_0-75; Library Ref: CAP; Chkd/date: MANIRAJA/241018; Crtd /date: ALVY/241018; Datasheet: Y:\MIS_DATABASE\DATASHEETS\CAPACITORS\GCM155R71C104JA55D.PDF; Temperature: -55°C+125°C; Weight: 6mg; Height: 0.55MM; Distributor_part_number: 490-16433-1-ND; Distributor_name: DIGIKEY; Tolerance: 5%; Automotive Alternate_mfr_name: TDK; Automotive Alternate_mfr_part_number: CGA2B1X7R1C104K050BC; PCB Footprint: CAP0402_0-75
C733 = CAP_Dup1: CAP CERAMIC 0.01uF 50V 10% X7R 0402; Part Reference: C733; Automotive Alternate_mfr_part_number: CGA2B3X7R1H103K050BB; Automotive Alternate_mfr_name: TDK; Direct Alternate_mfr_part_number: C1005X7R1H103K050BE; Part_type: CAPACITORS\CERAMIC; Mfr_part_number: C0402C103K5RACTU; Mfr_name: KEMET; Mistral Part No: 120009030025-R; Wattage: NA; Custom_Duty: 15%; Customs_HS_Code: 85322990; Project: G4_SVGA; Value: 0.01uF; Direct Alternate_mfr_name: TDK; Footprint Path: Y:\MIS_DATABASE\Library\ALTIUM_TOOL\PCB_FOOTPRINTS\Altium_Footprint_Lib.PcbLib; Library Path: Y:\MIS_DATABASE\Library\ALTIUM_TOOL\SCHEMATICS_PARTS\MS_DISCRETE_Library.schlib; MECHANICAL 3D STEP FILE: CAP0402_0-75; Temperature: -55°C+125°C; Weight: 0.65mg; Footprint Ref: CAP0402_0-75; Chkd/date: SHREESHAIL/301105; Crtd /date: MAZHAR/040505; Datasheet: Y:\MIS_DATABASE\DATASHEETS\CAPACITORS\KEMET-C-X7R.PDF; Height: 0.55MM; Library Ref: CAP; Distributor_part_number: 399-3066-1-ND; Distributor_name: DIGIKEY; Tolerance: 10%; PCB Footprint: CAP0402_0-75
C736 = CAP_Dup1: CAP CERAMIC 0.01uF 50V 10% X7R 0402; Part Reference: C736; Automotive Alternate_mfr_part_number: CGA2B3X7R1H103K050BB; Automotive Alternate_mfr_name: TDK; Direct Alternate_mfr_part_number: C1005X7R1H103K050BE; Part_type: CAPACITORS\CERAMIC; Mfr_part_number: C0402C103K5RACTU; Mfr_name: KEMET; Mistral Part No: 120009030025-R; Wattage: NA; Custom_Duty: 15%; Customs_HS_Code: 85322990; Project: G4_SVGA; Value: 0.01uF; Direct Alternate_mfr_name: TDK; Footprint Path: Y:\MIS_DATABASE\Library\ALTIUM_TOOL\PCB_FOOTPRINTS\Altium_Footprint_Lib.PcbLib; Library Path: Y:\MIS_DATABASE\Library\ALTIUM_TOOL\SCHEMATICS_PARTS\MS_DISCRETE_Library.schlib; MECHANICAL 3D STEP FILE: CAP0402_0-75; Temperature: -55°C+125°C; Weight: 0.65mg; Footprint Ref: CAP0402_0-75; Chkd/date: SHREESHAIL/301105; Crtd /date: MAZHAR/040505; Datasheet: Y:\MIS_DATABASE\DATASHEETS\CAPACITORS\KEMET-C-X7R.PDF; Height: 0.55MM; Library Ref: CAP; Distributor_part_number: 399-3066-1-ND; Distributor_name: DIGIKEY; Tolerance: 10%; PCB Footprint: CAP0402_0-75
C737 = CAP_Dup1: CAP CERAMIC 0.1uF 16V 5% X7R AUTO 0402; Part Reference: C737; Automotive Alternate_mfr_part_number: CGA2B1X7R1C104K050BC; Automotive Alternate_mfr_name: TDK; Mistral Part No: 120018100055-R; Mfr_name: MURATA; Mfr_part_number: GCM155R71C104JA55D; Part_type: CAPACITORS\CERAMIC; Project: TI_J7ES_EVM_CP; Wattage: NA; Customs_HS_Code: 85322990; Custom_Duty: 15%; Value: 0.1uF; Direct Alternate_mfr_part_number: CGA2B1X7R1C104K050BC; Direct Alternate_mfr_name: TDK; Tolerance: 5%; Distributor_name: DIGIKEY; Distributor_part_number: 490-16433-1-ND; Height: 0.55MM; Weight: 6mg; Temperature: -55°C+125°C; Datasheet: Y:\MIS_DATABASE\DATASHEETS\CAPACITORS\GCM155R71C104JA55D.PDF; Crtd /date: ALVY/241018; Chkd/date: MANIRAJA/241018; Library Ref: CAP; Footprint Ref: CAP0402_0-75; Library Path: Y:\MIS_DATABASE\Library\ALTIUM_TOOL\SCHEMATICS_PARTS\MS_DISCRETE_Library.schlib; Footprint Path: Y:\MIS_DATABASE\Library\ALTIUM_TOOL\PCB_FOOTPRINTS\Altium_Footprint_Lib.PcbLib; MECHANICAL 3D STEP FILE: CAP0402_0-75; PCB Footprint: CAP0402_0-75
C746 = CAP_Dup1: CAP CERAMIC 0.01uF 50V 10% X7R 0402; Part Reference: C746; Mistral Part No: 120009030025-R; Mfr_name: KEMET; Mfr_part_number: C0402C103K5RACTU; Part_type: CAPACITORS\CERAMIC; Direct Alternate_mfr_name: TDK; Direct Alternate_mfr_part_number: C1005X7R1H103K050BE; Automotive Alternate_mfr_part_number: CGA2B3X7R1H103K050BB; Project: G4_SVGA; Customs_HS_Code: 85322990; Custom_Duty: 15%; Wattage: NA; Value: 0.01uF; Tolerance: 10%; Distributor_name: DIGIKEY; Distributor_part_number: 399-3066-1-ND; Library Ref: CAP; Height: 0.55MM; Datasheet: Y:\MIS_DATABASE\DATASHEETS\CAPACITORS\KEMET-C-X7R.PDF; Crtd /date: MAZHAR/040505; Chkd/date: SHREESHAIL/301105; Footprint Ref: CAP0402_0-75; Weight: 0.65mg; Temperature: -55°C+125°C; MECHANICAL 3D STEP FILE: CAP0402_0-75; Library Path: Y:\MIS_DATABASE\Library\ALTIUM_TOOL\SCHEMATICS_PARTS\MS_DISCRETE_Library.schlib; Footprint Path: Y:\MIS_DATABASE\Library\ALTIUM_TOOL\PCB_FOOTPRINTS\Altium_Footprint_Lib.PcbLib; Automotive Alternate_mfr_name: TDK; PCB Footprint: CAP0402_0-75
C748 = CAP_Dup1: CAP CERAMIC 0.01uF 50V 10% X7R 0402; Part Reference: C748; Mistral Part No: 120009030025-R; Mfr_name: KEMET; Mfr_part_number: C0402C103K5RACTU; Part_type: CAPACITORS\CERAMIC; Direct Alternate_mfr_name: TDK; Direct Alternate_mfr_part_number: C1005X7R1H103K050BE; Automotive Alternate_mfr_part_number: CGA2B3X7R1H103K050BB; Project: G4_SVGA; Customs_HS_Code: 85322990; Custom_Duty: 15%; Wattage: NA; Value: 0.01uF; Tolerance: 10%; Distributor_name: DIGIKEY; Distributor_part_number: 399-3066-1-ND; Library Ref: CAP; Height: 0.55MM; Datasheet: Y:\MIS_DATABASE\DATASHEETS\CAPACITORS\KEMET-C-X7R.PDF; Crtd /date: MAZHAR/040505; Chkd/date: SHREESHAIL/301105; Footprint Ref: CAP0402_0-75; Weight: 0.65mg; Temperature: -55°C+125°C; MECHANICAL 3D STEP FILE: CAP0402_0-75; Library Path: Y:\MIS_DATABASE\Library\ALTIUM_TOOL\SCHEMATICS_PARTS\MS_DISCRETE_Library.schlib; Footprint Path: Y:\MIS_DATABASE\Library\ALTIUM_TOOL\PCB_FOOTPRINTS\Altium_Footprint_Lib.PcbLib; Automotive Alternate_mfr_name: TDK; PCB Footprint: CAP0402_0-75
C749 = CAP_Dup1: CAP CERAMIC 0.01uF 50V 10% X7R 0402; Part Reference: C749; Automotive Alternate_mfr_part_number: CGA2B3X7R1H103K050BB; Automotive Alternate_mfr_name: TDK; Direct Alternate_mfr_part_number: C1005X7R1H103K050BE; Part_type: CAPACITORS\CERAMIC; Mfr_part_number: C0402C103K5RACTU; Mfr_name: KEMET; Mistral Part No: 120009030025-R; Wattage: NA; Custom_Duty: 15%; Customs_HS_Code: 85322990; Project: G4_SVGA; Value: 0.01uF; Direct Alternate_mfr_name: TDK; Footprint Path: Y:\MIS_DATABASE\Library\ALTIUM_TOOL\PCB_FOOTPRINTS\Altium_Footprint_Lib.PcbLib; Library Path: Y:\MIS_DATABASE\Library\ALTIUM_TOOL\SCHEMATICS_PARTS\MS_DISCRETE_Library.schlib; MECHANICAL 3D STEP FILE: CAP0402_0-75; Temperature: -55°C+125°C; Weight: 0.65mg; Footprint Ref: CAP0402_0-75; Chkd/date: SHREESHAIL/301105; Crtd /date: MAZHAR/040505; Datasheet: Y:\MIS_DATABASE\DATASHEETS\CAPACITORS\KEMET-C-X7R.PDF; Height: 0.55MM; Library Ref: CAP; Distributor_part_number: 399-3066-1-ND; Distributor_name: DIGIKEY; Tolerance: 10%; PCB Footprint: CAP0402_0-75
C750 = CAP_Dup1: CAP CERAMIC 0.01uF 50V 10% X7R 0402; Part Reference: C750; Automotive Alternate_mfr_part_number: CGA2B3X7R1H103K050BB; Automotive Alternate_mfr_name: TDK; Direct Alternate_mfr_part_number: C1005X7R1H103K050BE; Part_type: CAPACITORS\CERAMIC; Mfr_part_number: C0402C103K5RACTU; Mfr_name: KEMET; Mistral Part No: 120009030025-R; Wattage: NA; Custom_Duty: 15%; Customs_HS_Code: 85322990; Project: G4_SVGA; Value: 0.01uF; Direct Alternate_mfr_name: TDK; Footprint Path: Y:\MIS_DATABASE\Library\ALTIUM_TOOL\PCB_FOOTPRINTS\Altium_Footprint_Lib.PcbLib; Library Path: Y:\MIS_DATABASE\Library\ALTIUM_TOOL\SCHEMATICS_PARTS\MS_DISCRETE_Library.schlib; MECHANICAL 3D STEP FILE: CAP0402_0-75; Temperature: -55°C+125°C; Weight: 0.65mg; Footprint Ref: CAP0402_0-75; Chkd/date: SHREESHAIL/301105; Crtd /date: MAZHAR/040505; Datasheet: Y:\MIS_DATABASE\DATASHEETS\CAPACITORS\KEMET-C-X7R.PDF; Height: 0.55MM; Library Ref: CAP; Distributor_part_number: 399-3066-1-ND; Distributor_name: DIGIKEY; Tolerance: 10%; PCB Footprint: CAP0402_0-75
C754 = CAP_Dup1: CAP CERAMIC 0.01uF 50V 10% X7R 0402; Part Reference: C754; Automotive Alternate_mfr_part_number: CGA2B3X7R1H103K050BB; Automotive Alternate_mfr_name: TDK; Direct Alternate_mfr_part_number: C1005X7R1H103K050BE; Part_type: CAPACITORS\CERAMIC; Mfr_part_number: C0402C103K5RACTU; Mfr_name: KEMET; Mistral Part No: 120009030025-R; Wattage: NA; Custom_Duty: 15%; Customs_HS_Code: 85322990; Project: G4_SVGA; Value: 0.01uF; Direct Alternate_mfr_name: TDK; Footprint Path: Y:\MIS_DATABASE\Library\ALTIUM_TOOL\PCB_FOOTPRINTS\Altium_Footprint_Lib.PcbLib; Library Path: Y:\MIS_DATABASE\Library\ALTIUM_TOOL\SCHEMATICS_PARTS\MS_DISCRETE_Library.schlib; MECHANICAL 3D STEP FILE: CAP0402_0-75; Temperature: -55°C+125°C; Weight: 0.65mg; Footprint Ref: CAP0402_0-75; Chkd/date: SHREESHAIL/301105; Crtd /date: MAZHAR/040505; Datasheet: Y:\MIS_DATABASE\DATASHEETS\CAPACITORS\KEMET-C-X7R.PDF; Height: 0.55MM; Library Ref: CAP; Distributor_part_number: 399-3066-1-ND; Distributor_name: DIGIKEY; Tolerance: 10%; PCB Footprint: CAP0402_0-75
C759 = CAP_Dup1: CAP CERAMIC 1uF 10V 10% X7S AUTO 0402; Part Reference: C759; Part_type: CAPACITORS\CERAMIC; Mfr_part_number: GCM155C71A105KE38D; Mfr_name: MURATA; Mistral Part No: 120018090021-R; Custom_Duty: 15%; Customs_HS_Code: 85322990; Wattage: NA; Project: SMART-M_SCRIPTALK_PB; Value: 1uF; Footprint Path: Y:\MIS_DATABASE\Library\ALTIUM_TOOL\PCB_FOOTPRINTS\Altium_Footprint_Lib.PcbLib; Library Path: Y:\MIS_DATABASE\Library\ALTIUM_TOOL\SCHEMATICS_PARTS\MS_DISCRETE_Library.schlib; MECHANICAL 3D STEP FILE: CAP0402_0-75; Chkd/date: MANIRAJA/100918; Crtd /date: ALVY/100918; Datasheet: Y:\MIS_DATABASE\DATASHEETS\CAPACITORS\MURATA-GCM-SER.PDF; Temperature: -55°C+125°C; Weight: 6mg; Height: 0.70MM; Distributor_part_number: 490-13409-1-ND; Distributor_name: DIGIKEY; Tolerance: 10%; Library Ref: CAP; Footprint Ref: CAP0402_0-75; PCB Footprint: CAP0402_0-75
C760 = CAP_Dup1: CAP CERAMIC 0.01uF 50V 10% X7R 0402; Part Reference: C760; Mistral Part No: 120009030025-R; Mfr_name: KEMET; Mfr_part_number: C0402C103K5RACTU; Part_type: CAPACITORS\CERAMIC; Direct Alternate_mfr_name: TDK; Direct Alternate_mfr_part_number: C1005X7R1H103K050BE; Automotive Alternate_mfr_part_number: CGA2B3X7R1H103K050BB; Project: G4_SVGA; Customs_HS_Code: 85322990; Custom_Duty: 15%; Wattage: NA; Value: 0.01uF; Tolerance: 10%; Distributor_name: DIGIKEY; Distributor_part_number: 399-3066-1-ND; Library Ref: CAP; Height: 0.55MM; Datasheet: Y:\MIS_DATABASE\DATASHEETS\CAPACITORS\KEMET-C-X7R.PDF; Crtd /date: MAZHAR/040505; Chkd/date: SHREESHAIL/301105; Footprint Ref: CAP0402_0-75; Weight: 0.65mg; Temperature: -55°C+125°C; MECHANICAL 3D STEP FILE: CAP0402_0-75; Library Path: Y:\MIS_DATABASE\Library\ALTIUM_TOOL\SCHEMATICS_PARTS\MS_DISCRETE_Library.schlib; Footprint Path: Y:\MIS_DATABASE\Library\ALTIUM_TOOL\PCB_FOOTPRINTS\Altium_Footprint_Lib.PcbLib; Automotive Alternate_mfr_name: TDK; PCB Footprint: CAP0402_0-75
C761 = CAP_Dup1: CAP CERAMIC 10uF 16V 20% X6S 0603; Part Reference: C761; Automotive Alternate_mfr_part_number: GRT188C81C106ME13D; Automotive Alternate_mfr_name: MURATA; Direct Alternate_mfr_part_number: CL10X106MO8NRNC; Direct Alternate_mfr_name: SAMSUNG; Part_type: CAPACITORS\CERAMIC; Mfr_part_number: GRM188C81C106MA73D; Mistral Part No: 120017010004-R; Custom_Duty: 15%; Customs_HS_Code: 85322990; Wattage: NA; Project: TRMM_SMART-M_PS; Value: 10uF; Footprint Path: Y:\MIS_DATABASE\Library\ALTIUM_TOOL\PCB_FOOTPRINTS\Altium_Footprint_Lib.PcbLib; Library Path: Y:\MIS_DATABASE\Library\ALTIUM_TOOL\SCHEMATICS_PARTS\MS_DISCRETE_Library.schlib; Footprint Ref: CAP0603_1; MECHANICAL 3D STEP FILE: CAP0603_1; Chkd/date: VASANTHA/170117; Crtd /date: VASANTHA/170117; Datasheet: Y:\MIS_DATABASE\DATASHEETS\CAPACITORS\MURATA-GXX-SER_NOV17.PDF; Temperature: -55°C+105°C; Weight: 6.3mg; Height: 0.90MM; Library Ref: CAP; Distributor_part_number: 490-7198-1-ND; Distributor_name: DIGIKEY; Tolerance: 20%; Mfr_name: MURATA; PCB Footprint: CAP0603_1
R468 = RESISTOR_Dup1: RES 1K 1/10W 1% 0402; Part Reference: R468; Mistral Part No: 110009030411-R; Mfr_name: PANASONIC-ECG; Mfr_part_number: ERJ-2RKF1001X; Part_type: RESISTORS\FIXED; Project: VOCERA; Voltage: NA; Customs_HS_Code: 85332119; Custom_Duty: 15%; Value: 1K_1%; Tolerance: 1%; Wattage: 1/10W; Package: 0402; Distributor_name: DIGIKEY; Distributor_part_number: P1.00KLCT-ND; Height: 0.40MM; Weight: 0.8mg; Temperature: -55°C+155°C; Datasheet: Y:\MIS_DATABASE\DATASHEETS\RESISTORS\PAN-ERJSER_NOV17.PDF; Crtd /date: MAZHAR/150506; Chkd/date: VASANTHA/281216; Library Ref: RESISTOR; Footprint Ref: RES0402_0-5; MECHANICAL 3D STEP FILE: RES0402_0-5; Library Path: Y:\MIS_DATABASE\Library\ALTIUM_TOOL\SCHEMATICS_PARTS\MS_DISCRETE_Library.schlib; Footprint Path: Y:\MIS_DATABASE\Library\ALTIUM_TOOL\PCB_FOOTPRINTS\Altium_Footprint_Lib.PcbLib; Manufacturer: PANASONIC-ECG; PCB Footprint: RES0402_0-5
R471 = RESISTOR_Dup2: RES 10K 1/16W 1% 0402; Part Reference: R471; Part_type: RESISTORS\FIXED; Mfr_part_number: RC0402FR-0710KL; Mfr_name: YAGEO AMERICA; Mistral Part No: 110015090015-R; Custom_Duty: 15%; Customs_HS_Code: 85332119; Voltage: NA; Project: VOCERA; Value: 10K_1%; MECHANICAL 3D STEP FILE: RES0402_0-5; Chkd/date: VASANTHA/201216; Crtd /date: GEETHA/290506; Datasheet: Y:\MIS_DATABASE\DATASHEETS\RESISTORS\RCXXXXL-SER_MAR18.PDF; Temperature: -55°C+155°C; Weight: 0.65mg; Height: 0.40MM; Distributor_part_number: 311-10.0KLRTR-ND; Distributor_name: DIGIKEY; Package: 0402; Wattage: 1/16W; Tolerance: 1%; Library Ref: RESISTOR; Footprint Ref: RES0402_0-5; Library Path: Y:\MIS_DATABASE\Library\ALTIUM_TOOL\SCHEMATICS_PARTS\MS_DISCRETE_Library.schlib; Footprint Path: Y:\MIS_DATABASE\Library\ALTIUM_TOOL\PCB_FOOTPRINTS\Altium_Footprint_Lib.PcbLib; PCB Footprint: RES0402_0-5
R497 = RESISTOR_Dup2: RES 240E 1/20W 1% 0201; Part Reference: R497; Part_type: RESISTORS\FIXED; Mfr_part_number: RC0201FR-07240RL; Mfr_name: YAGEO AMERICA; Mistral Part No: 110016110007-R; Custom_Duty: 15%; Customs_HS_Code: 85332119; Voltage: NA; Project: ALL_DATA_NANO_SOM; Value: 240E_1%; Footprint Path: Y:\MIS_DATABASE\Library\ALTIUM_TOOL\PCB_FOOTPRINTS\Altium_Footprint_Lib.PcbLib; Library Path: Y:\MIS_DATABASE\Library\ALTIUM_TOOL\SCHEMATICS_PARTS\MS_DISCRETE_Library.schlib; Footprint Ref: RES0201_0-5; MECHANICAL 3D STEP FILE: RES0201_0-5; Chkd/date: VASANTHA/251116; Crtd /date: MANIRAJA/241116; Datasheet: Y:\MIS_DATABASE\DATASHEETS\RESISTORS\RCXXXXL-SER_MAR18.PDF; Temperature: -55°C+125°C; Weight: 0.17mg; Height: 0.26MM; Library Ref: RESISTOR; Distributor_part_number: YAG2528CT-ND; Distributor_name: DIGIKEY; Package: 0201; Wattage: 1/20W; PCB Footprint: RES0201_0-5
R500 = RESISTOR_Dup2: RES 240E 1/20W 1% 0201; Part Reference: R500; Mistral Part No: 110016110007-R; Mfr_name: YAGEO AMERICA; Mfr_part_number: RC0201FR-07240RL; Part_type: RESISTORS\FIXED; Project: ALL_DATA_NANO_SOM; Voltage: NA; Customs_HS_Code: 85332119; Custom_Duty: 15%; Value: 240E_1%; Wattage: 1/20W; Package: 0201; Distributor_name: DIGIKEY; Distributor_part_number: YAG2528CT-ND; Library Ref: RESISTOR; Height: 0.26MM; Weight: 0.17mg; Temperature: -55°C+125°C; Datasheet: Y:\MIS_DATABASE\DATASHEETS\RESISTORS\RCXXXXL-SER_MAR18.PDF; Crtd /date: MANIRAJA/241116; Chkd/date: VASANTHA/251116; MECHANICAL 3D STEP FILE: RES0201_0-5; Footprint Ref: RES0201_0-5; Library Path: Y:\MIS_DATABASE\Library\ALTIUM_TOOL\SCHEMATICS_PARTS\MS_DISCRETE_Library.schlib; Footprint Path: Y:\MIS_DATABASE\Library\ALTIUM_TOOL\PCB_FOOTPRINTS\Altium_Footprint_Lib.PcbLib; PCB Footprint: RES0201_0-5
R512 = RESISTOR_Dup2: RES 10K 1/16W 1% 0402; Part Reference: R512; Mistral Part No: 110015090015-R; Mfr_name: YAGEO AMERICA; Mfr_part_number: RC0402FR-0710KL; Part_type: RESISTORS\FIXED; Project: VOCERA; Voltage: NA; Customs_HS_Code: 85332119; Custom_Duty: 15%; Value: 10K_1%; Footprint Path: Y:\MIS_DATABASE\Library\ALTIUM_TOOL\PCB_FOOTPRINTS\Altium_Footprint_Lib.PcbLib; Library Path: Y:\MIS_DATABASE\Library\ALTIUM_TOOL\SCHEMATICS_PARTS\MS_DISCRETE_Library.schlib; Footprint Ref: RES0402_0-5; Library Ref: RESISTOR; Tolerance: 1%; Wattage: 1/16W; Package: 0402; Distributor_name: DIGIKEY; Distributor_part_number: 311-10.0KLRTR-ND; Height: 0.40MM; Weight: 0.65mg; Temperature: -55°C+155°C; Datasheet: Y:\MIS_DATABASE\DATASHEETS\RESISTORS\RCXXXXL-SER_MAR18.PDF; Crtd /date: GEETHA/290506; Chkd/date: VASANTHA/201216; MECHANICAL 3D STEP FILE: RES0402_0-5; PCB Footprint: RES0402_0-5
R514 = RESISTOR_Dup2: RES 10K 1/16W 1% 0402; Part Reference: R514; Part_type: RESISTORS\FIXED; Mfr_part_number: RC0402FR-0710KL; Mfr_name: YAGEO AMERICA; Mistral Part No: 110015090015-R; Custom_Duty: 15%; Customs_HS_Code: 85332119; Voltage: NA; Project: VOCERA; Value: 10K_1%; MECHANICAL 3D STEP FILE: RES0402_0-5; Chkd/date: VASANTHA/201216; Crtd /date: GEETHA/290506; Datasheet: Y:\MIS_DATABASE\DATASHEETS\RESISTORS\RCXXXXL-SER_MAR18.PDF; Temperature: -55°C+155°C; Weight: 0.65mg; Height: 0.40MM; Distributor_part_number: 311-10.0KLRTR-ND; Distributor_name: DIGIKEY; Package: 0402; Wattage: 1/16W; Tolerance: 1%; Library Ref: RESISTOR; Footprint Ref: RES0402_0-5; Library Path: Y:\MIS_DATABASE\Library\ALTIUM_TOOL\SCHEMATICS_PARTS\MS_DISCRETE_Library.schlib; Footprint Path: Y:\MIS_DATABASE\Library\ALTIUM_TOOL\PCB_FOOTPRINTS\Altium_Footprint_Lib.PcbLib; PCB Footprint: RES0402_0-5
R525 = RESISTOR_Dup2: RES 240E 1/20W 1% 0201; Part Reference: R525; Manufacturer: YAGEO AMERICA; Part_type: RESISTORS\FIXED; Mfr_part_number: RC0201FR-07240RL; Mistral Part No: 110016110007-R; Part #: 103413-2401R; Custom_Duty: 15%; Customs_HS_Code: 85332119; Voltage: NA; Project: ALL_DATA_NANO_SOM; Value: 240E_1%; MECHANICAL 3D STEP FILE: RES0201_0-5; Chkd/date: VASANTHA/251116; Crtd /date: MANIRAJA/241116; Datasheet: Y:\MIS_DATABASE\DATASHEETS\RESISTORS\RCXXXXL-SER_MAR18.PDF; Temperature: -55°C+125°C; Weight: 0.17mg; Height: 0.26MM; Library Ref: RESISTOR; Distributor_part_number: YAG2528CT-ND; Distributor_name: DIGIKEY; Wattage: 1/20W; Tolerance: 1%; Mfr_name: YAGEO AMERICA; Footprint Ref: RES0201_0-5; Library Path: Y:\MIS_DATABASE\Library\ALTIUM_TOOL\SCHEMATICS_PARTS\MS_DISCRETE_Library.schlib; Footprint Path: Y:\MIS_DATABASE\Library\ALTIUM_TOOL\PCB_FOOTPRINTS\Altium_Footprint_Lib.PcbLib; PCB Footprint: RES0201_0-5
U28 = J7AHPSoC-EVM_BGA1414: IC AM69 SoC EVM MICROPROCESSOR BGA1414; Part Reference: U28; Manufacturer: TEXAS INSTRUMENTS; Part_type: ICS\DIGITAL\MICROPROCESSOR; Mistral Part No: 141230020002; SPLIT_INST: TRUE; SWAP_INFO: (S1+S2+S3+S4+S5+S6+S7+S8+S9+S10+S11+S12+S13+S14+S15+S16+S17+S18+S19+S20+S21+S22+S23+S24+S25+S26); Custom_Duty: 15%; Customs_HS_Code: 85423100; Wattage: NA; Project: TI_J7AHP SK_BRD; Value: XJ784S45AALY; Footprint Path: Y:\MIS_DATABASE\Library\ALTIUM_TOOL\PCB_FOOTPRINTS\Altium_Footprint_Lib.PcbLib; Library Path: Y:\MIS_DATABASE\Library\ALTIUM_TOOL\SCHEMATICS_PARTS\MS_MICROPROCESSOR_Library.schlib; MECHANICAL 3D STEP FILE: BGA1414_31-49_1230X1230_2-7; RoHS: NA; Chkd/date: MANIRAJA/151221; Crtd /date: ALVY/141221; Datasheet: Y:\MIS_DATABASE\DATASHEETS\ICS\DIGITAL\MICROCONTROLLER\J7AHP-SoC-EVM.PDF; Temperature: NA; Weight: NA; Height: 2.70MM; Library Ref: J7AHPSoC-EVM_BGA1414; Distributor_part_number: NA; Distributor_name: NA; Package: BGA1414; Voltage: NA; Tolerance: NA; Mfr_part_number: XJ784S45AALY; Mfr_name: TEXAS INSTRUMENTS; Footprint Ref: BGA1414_31-49_1230X1230_2-7; PCB Footprint: BGA1414_31-49_1230X1230_2-7
U44 = MT53D1024M32D4DT_VFBGA200: IC 8Gb AUTO LPDDR4/LPDDR4x SDRAM TFBGA200; Part Reference: U44; Manufacturer: MICRON; Mistral Part No: 141122010003-R; Part_type: ICS\DIGITAL\MEMORY; Project: J7AHP_PROTO_BRD; Tolerance: NA; Customs_HS_Code: 85423100; Custom_Duty: 15%; MECHANICAL 3D STEP FILE: WFBGA200_MT53E2G_400X570_1-2; Value: MT53E2G32D4DE-046 AUT:C; Footprint Ref: WFBGA200_MT53DDS_400X570_1-2; Mfr_name: MICRON; Mfr_part_number: MT53E2G32D4DE-046 AUT:C; Voltage: NA; Wattage: NA; Package: TFBGA200; Distributor_name: NA; Distributor_part_number: NA; Library Ref: MT53D1024M32D4DT_VFBGA200; Height: 1.14MM; Weight: NA; Temperature: -40°C+125°C; Datasheet: Y:\MIS_DATABASE\DATASHEETS\ICS\MEMORY\MT53EX-C-AUTO.PDF; Crtd /date: MANIRAJA/170122; Chkd/date: ALVY/170122; Library Path: Y:\MIS_DATABASE\Library\ALTIUM_TOOL\SCHEMATICS_PARTS\MS_MISCMEMORY_Library.schlib; Footprint Path: Y:\MIS_DATABASE\Library\ALTIUM_TOOL\PCB_FOOTPRINTS\Altium_Footprint_Lib.PcbLib; PCB Footprint: WFBGA200_MT53DDS_400X570_1-2